# Altium schematic sheet rf_detector_adcdac.SchDoc: SPE Router
size 420 x 297 mm; Author: P. Daniel; CompanyName: WUT ISE; DrawnBy: P. Daniel; Organization: WUT ISE; Address1: WUT ISE; Address2: Nowowiejska 15/19 00-665 Warsaw; Address3: piotrmaciejdaniel@gmail.com; Revision: 1; SheetNumber: 3; SheetTotal: 6; ModifiedBy: -; CreateDate: 02-03.2023; CheckedDate: -; Title2: PoE power supply; DivGrp: WUT ISE; Designer: Piotr Daniel
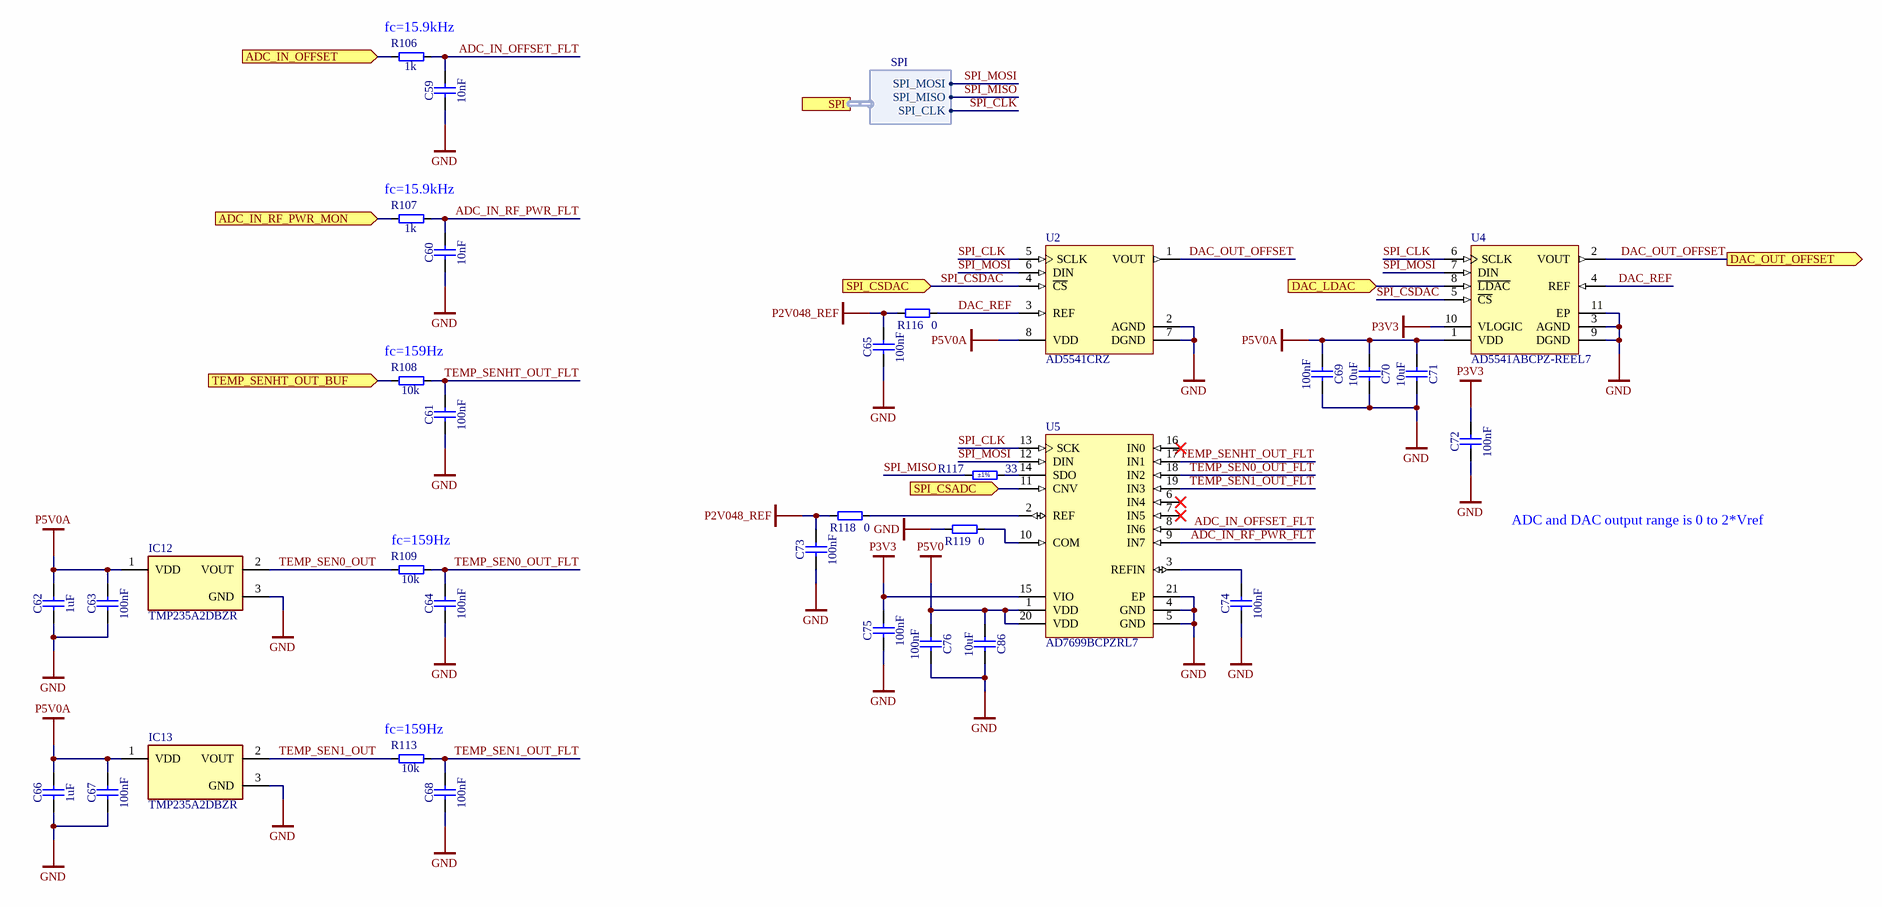
[diagram p0: rf_detector_adcdac.SchDoc]

## Parts
C59  10nF  [CAPC1005X55N]
C60  10nF  [CAPC1005X55N]
C61  100nF  [CAPC1005X55N]
C62  1uF  [CAPC1608X87N]
C63  100nF  [CAPC1005X55N]
C64  100nF  [CAPC1005X55N]
C65  100nF  [CAPC1005X55N]
C66  1uF  [CAPC1608X87N]
C67  100nF  [CAPC1005X55N]
C68  100nF  [CAPC1005X55N]
C69  100nF  [CAPC1005X55N]
C70  10uF  [CAPC2012X135N]
C71  10uF  [CAPC2012X135N]
C72  100nF  [CAPC1005X55N]
C73  100nF  [CAPC1005X55N]
C74  100nF  [CAPC1005X55N]
C75  100nF  [CAPC1005X55N]
C76  100nF  [CAPC1005X55N]
C86  10uF  [CAPC2012X135N]
IC12  TMP235A2DBZR  [FP-DBZ0003A-MFG]
IC13  TMP235A2DBZR  [FP-DBZ0003A-MFG]
R106  1k  [RESC1005X40N]
R107  1k  [RESC1005X40N]
R108  10k  [RESC1005X40N]
R109  10k  [RESC1005X40N]
R113  10k  [RESC1005X40N]
R116  0  [RESC1005X40N]
R117  33  Tolerance: ±1%  [RESC1005X40N]
R118  0  [RESC1005X40N]
R119  0  [RESC1005X40N]
U2  AD5541CRZ  [R-8_N]
U4  AD5541ABCPZ-REEL7  [CP-10-9_L]
U5  AD7699BCPZRL7  [CP-20-4_M]

## Ports
ADC_IN_OFFSET (in), ADC_IN_RF_PWR_MON (in), DAC_LDAC (in), DAC_OUT_OFFSET (out), SPI (harness SPI), SPI_CSADC (in), SPI_CSDAC (in), TEMP_SENHT_OUT_BUF (in)

## Harnesses
SPI: SPI_MOSI, SPI_MISO, SPI_CLK

## Nets
GND: C59.1 C60.1 C61.1 C62.1 C63.1 C64.1 C65.1 C66.1 C67.1 C68.1 C69.1 C70.1 C71.1 C72.1 C73.1 C74.1 C75.1 C76.1 C86.1 IC12.3(GND) IC13.3(GND) R119.2 U2.2(AGND) U2.7(DGND) U4.3(AGND) U4.9(DGND) U4.11(EP) U5.4(GND) U5.5(GND) U5.21(EP)
P2V048_REF: C65.2 C73.2 R116.2 R118.2
P3V3: C72.2 C75.2 U4.10(VLOGIC) U5.15(VIO)
P5V0: C76.2 C86.2 U5.1(VDD) U5.20(VDD)
P5V0A: C62.2 C63.2 C66.2 C67.2 C69.2 C70.2 C71.2 IC12.1(VDD) IC13.1(VDD) U2.8(VDD) U4.1(VDD)
ADC_IN_OFFSET: R106.1 ; port ADC_IN_OFFSET
ADC_IN_OFFSET_FLT: C59.2 R106.2 U5.8(IN6)
ADC_IN_RF_PWR_FLT: C60.2 R107.2 U5.9(IN7)
ADC_IN_RF_PWR_MON: R107.1 ; port ADC_IN_RF_PWR_MON
DAC_LDAC: U4.8(~{LDAC}) ; port DAC_LDAC
DAC_OUT_OFFSET: U2.1(VOUT) U4.2(VOUT) ; port DAC_OUT_OFFSET
DAC_REF: R116.1 U2.3(REF) U4.4(REF)
SPI_CLK: U2.5(SCLK) U4.6(SCLK) U5.13(SCK) ; port SPI.SPI_CLK
SPI_CSADC: U5.11(CNV) ; port SPI_CSADC
SPI_CSDAC: U2.4(~{CS}) U4.5(~{CS}) ; port SPI_CSDAC
SPI_MISO: R117.1 ; port SPI.SPI_MISO
SPI_MOSI: U2.6(DIN) U4.7(DIN) U5.12(DIN) ; port SPI.SPI_MOSI
TEMP_SEN0_OUT: IC12.2(VOUT) R109.1
TEMP_SEN0_OUT_FLT: C64.2 R109.2 U5.18(IN2)
TEMP_SEN1_OUT: IC13.2(VOUT) R113.1
TEMP_SEN1_OUT_FLT: C68.2 R113.2 U5.19(IN3)
TEMP_SENHT_OUT_BUF: R108.1 ; port TEMP_SENHT_OUT_BUF
TEMP_SENHT_OUT_FLT: C61.2 R108.2 U5.17(IN1)
NetC74_2: C74.2 U5.3(REFIN)
NetR117_2: R117.2 U5.14(SDO)
NetR118_1: R118.1 U5.2(REF)
NetR119_1: R119.1 U5.10(COM)

Not connected (* = marked no-connect by the designer): U5 6(IN4)* 7(IN5)* 16(IN0)*

## Notes on the sheet
- (near R106) fc=15.9kHz
- (near R107) fc=15.9kHz
- (near R108) fc=159Hz
- (near R109) fc=159Hz
- ADC and DAC output range is 0 to 2*Vref
- (near R113) fc=159Hz
- Project/Equipment
- Document
- Designer
- Drawn by
- Check.by
- Copyright WUT ISE 2021.
  This documentation describes Open Hardware and is licensed under the CERN OHL v.1.1. You may redistribute and modify this documentation under the terms of the CERN OHL v.1.1. (http://ohwr.org/CERNOHL). This documentation is distributed WITHOUT ANY EXPRESS OR IMPLIED WARRANTY, INCLUDING OF MERCHANTABILITY, SATISFACTORY QUALITY AND FITNESS FOR A PARTICULAR PURPOSE. Please see the CERN OHL v.1.1 for applicable conditions.
- Contact
- File
- Last Mod.
- Print Date
- Sheet
- Size
- A3
- of
- Rev

## Library data of the parts
C59 C60 = CC0402_10NF_25V_10%_X7R: Non-polarised capacitor; Part Description: SMD Multilayer Chip Ceramic Capacitor; Manufacturer: GENERIC; Manufacturer1 Part Number: C1005X7R1E103K050; Voltage: 25V; TC: X7R; Tolerance: ±10%; Part Number: CC0402_10NF_25V_10%_X7R; Component Kind: Standard; Component Type: Standard; Pin Count: 2; Value: 10nF; Status: Preferred; Manufacturer Part Number: CC0402_10NF_25V_10%_X7R; Case: 0402; Mounted: Yes; Socket: No; SMD: Yes; Sense: No; Manufacturer1 Example: TDK; Manufacturer1 ComponentHeight: 0.55mm; HelpURL: \\cern.ch\dfs\Applications\Altium\Datasheets\CC0402_X7R_TDK_C.pdf; Author: CERN DEM JLC; CreateDate: 25.10.2012; LatestRevisionDate: 25.10.2012
C61 C63-C65 C67-C69 C72-C76 = CC0402_100NF_16V_10%_X7R: Non-polarised capacitor; Part Description: SMD Multilayer Chip Ceramic Capacitor; Manufacturer: GENERIC; Manufacturer1 Part Number: GRM155R71C104KA88D; Voltage: 16V; TC: X7R; Tolerance: ±10%; Part Number: CC0402_100NF_16V_10%_X7R; Component Kind: Standard; Component Type: Standard; Pin Count: 2; Value: 100nF; Status: Not Recommended; Manufacturer Part Number: CC0402_100NF_16V_10%_X7R; Case: 0402; Mounted: Yes; Socket: No; SMD: Yes; Sense: No; Manufacturer1 Example: MURATA; Manufacturer1 ComponentHeight: 0.55mm; HelpURL: \\cern.ch\dfs\Applications\Altium\Datasheets\CC0402_X7R_MURATA_GRM.pdf; Author: CERN DEM JLC; CreateDate: 05.12.2013; LatestRevisionDate: 03.12.2007
C62 C66 = CC0603_1UF_25V_10%_X7R: Non-polarised capacitor; Part Description: SMD Multilayer Chip Ceramic Capacitor; Manufacturer: GENERIC; Manufacturer1 Part Number: GRM188R71E105KA12D; Voltage: 25V; TC: X7R; Tolerance: ±10%; Part Number: CC0603_1UF_25V_10%_X7R; Component Kind: Standard; Component Type: Standard; Pin Count: 2; Value: 1uF; Status: None; Manufacturer Part Number: CC0603_1UF_25V_10%_X7R; Case: 0603; Mounted: Yes; Socket: No; SMD: Yes; Sense: No; Manufacturer1 Example: MURATA; Manufacturer1 ComponentHeight: 0.9mm; HelpURL: \\cern.ch\dfs\Applications\Altium\Datasheets\CC0603_X7R_MURATA.pdf; Author: CERN DEM JLC; CreateDate: 18.01.2011; LatestRevisionDate: 18.01.2011
C70 C71 C86 = CC0805_10UF_10V_10%_X7R: Non-polarised capacitor; Part Description: SMD Multilayer Chip Ceramic Capacitor; Manufacturer: GENERIC; Manufacturer1 Part Number: GRM21BR71A106KE51L; Voltage: 10V; TC: X7R; Tolerance: ±10%; Part Number: CC0805_10UF_10V_10%_X7R; Component Kind: Standard; Component Type: Standard; Pin Count: 2; Value: 10uF; Status: Preferred; Manufacturer Part Number: CC0805_10UF_10V_10%_X7R; Case: 0805; Mounted: Yes; Socket: No; SMD: Yes; Sense: No; Manufacturer1 Example: MURATA; Manufacturer1 ComponentHeight: 1.35mm; HelpURL: \\cern.ch\dfs\Applications\Altium\Datasheets\CC0805_X7R_MURATA.pdf; Author: CERN DEM JLC; CreateDate: 30.04.2012; LatestRevisionDate: 30.04.2012
IC12 IC13 = CMP-04948-000003-1: LOW-POWER HIGH-ACCURACY ANALOG O; Manufacturer: Texas Instruments; Output Current: 500uA; Operating Supply Current: 9uA; Max Supply Voltage: 5.5V; Max Junction Temp: +150°C; Accuracy: 0.5%; Min Supply Voltage: 2.3V; Standoff Height: 0.01mm; Sensor Output: Analog Voltage; Ambient Temperature Range Low: -40°C; Device Class L2: Temperature and Humidity Sensors; Digikey Description: LOW-POWER HIGH-ACCURACY ANALOG O; Lead Free: Yes; Category: IC; Device Class L3: unset; Temperature Range Low: -40°C; Manufacturer Part Number: TMP235A2DBZR; ComponentLink2Description: Datasheet; Package: DBZ0003A; Octopart: https://octopart.com/tmp235a2dbzr-texas+instruments-94966376; Device Class L1: Sensors; Temperature Range High: +150°C; Height: 1.12mm; Temperature: -40°C to +150°C; RoHS: TRUE; Ambient Temperature Range High: +150°C; Automotive: No; ComponentLink2URL: http://www.ti.com/lit/ds/symlink/tmp235.pdf; Mouser Description: ±2°C Analog output temperature sensor, with 10mV /°C gain 3-SOT-23 -40 to 150; Part Number: TMP235A2DBZR
R106 R107 = R0402_1K_1%_0.0625W_100PPM: Resistor - 1%; Part Description: General Purpose Thick Film Chip Resistor; Manufacturer: GENERIC; Manufacturer1 Part Number: 232270671002L; TC: ±100ppm/°C; PressFit: No; Part Number: R0402_1K_1%_0.0625W_100PPM; Component Kind: Standard; Component Type: Standard; Pin Count: 2; Value: 1k; Status: Not Recommended; Power: 0.0625W; Tolerance: ±1%; Manufacturer Part Number: R0402_1K_1%_0.0625W_100PPM; Case: 0402; Mounted: Yes; Sense: No; Socket: No; SMD: Yes; Manufacturer1 Example: YAGEO PHYCOMP; Manufacturer1 ComponentHeight: 0.4mm; HelpURL: \\cern.ch\dfs\Applications\Altium\Datasheets\R0402_Phycomp_RC0402.pdf; Author: CERN DEM JLC; CreateDate: 03.12.2007; LatestRevisionDate: 17.10.2012
R108 R109 R113 = R0402_10K_1%_0.0625W_100PPM: Resistor - 1%; Part Description: General Purpose Thick Film Chip Resistor; Manufacturer: GENERIC; Manufacturer1 Part Number: 232270671003L; TC: ±100ppm/°C; PressFit: No; Part Number: R0402_10K_1%_0.0625W_100PPM; Component Kind: Standard; Component Type: Standard; Pin Count: 2; Value: 10k; Status: Not Recommended; Power: 0.0625W; Tolerance: ±1%; Manufacturer Part Number: R0402_10K_1%_0.0625W_100PPM; Case: 0402; Mounted: Yes; Sense: No; Socket: No; SMD: Yes; Manufacturer1 Example: YAGEO PHYCOMP; Manufacturer1 ComponentHeight: 0.4mm; HelpURL: \\cern.ch\dfs\Applications\Altium\Datasheets\R0402_Phycomp_RC0402.pdf; Author: CERN DEM JLC; CreateDate: 03.12.2007; LatestRevisionDate: 17.10.2012
R116 R118 R119 = R0402_0R_JUMPER: Resistor; Part Description: 1A (0.05R Max DC Resistance) Zero Ohm Jumper; Manufacturer: GENERIC; Manufacturer1 Part Number: 232270591001L; Part Number: R0402_0R_JUMPER; Component Kind: Standard; Component Type: Standard; Pin Count: 2; Value: 0; Status: Not recommended; Manufacturer Part Number: R0402_0R_JUMPER; Case: 0402; Mounted: Yes; Sense: No; Socket: No; SMD: Yes; Manufacturer1 Example: YAGEO PHYCOMP; Manufacturer1 ComponentHeight: 0.4mm; HelpURL: \\cern.ch\dfs\Applications\Altium\Datasheets\R0402_Phycomp_RC0402.pdf; Author: CERN DEM JLC; CreateDate: 03.12.2007; LatestRevisionDate: 17.10.2012
R117 = R0402_33R_1%_0.0625W_100PPM: Resistor - 1%; Part Description: General Purpose Thick Film Chip Resistor; Manufacturer: GENERIC; Manufacturer1 Part Number: 232270673309L; TC: ±100ppm/°C; PressFit: No; Part Number: R0402_33R_1%_0.0625W_100PPM; Component Kind: Standard; Component Type: Standard; Pin Count: 2; Value: 33; Status: Not Recommended; Power: 0.0625W; Manufacturer Part Number: R0402_33R_1%_0.0625W_100PPM; Case: 0402; Mounted: Yes; Sense: No; Socket: No; SMD: Yes; Manufacturer1 Example: YAGEO PHYCOMP; Manufacturer1 ComponentHeight: 0.4mm; HelpURL: \\cern.ch\dfs\Applications\Altium\Datasheets\R0402_Phycomp_RC0402.pdf; Author: CERN DEM JLC; CreateDate: 03.12.2007; LatestRevisionDate: 17.10.2012
U2 = CMP-0318-00925-2: Single 16-Bit Digital-to-Analog Converter with Serial Interface, 2.7 to 5.5 V, -40 to +85 degC, R-8, Pb-Free, Tube; Manufacturer: Analog Devices; Generic Part Number: AD5541; Max V+: 5.5V; Op Pwr Diss: 6.05mW; Settling Time: 1Âµs; # DAC Outputs: 1; Resolution (Bits): 16; Single Supply: Yes; ComponentLink3Description: Package Specification; Packing: Tube; Code_IPC: SOIC127P600-8; ComponentLink2Description: Datasheet; RoHS: Y; ComponentLink3URL: http://www.analog.com/static/imported-files/packages/PKG_PDF/SOIC_Narrow%20(R)/R_8.pdf; PackageVersion: 060506-A; Code_JEDEC: MS-012-AA; ComponentLink5Description: Reference Design URL; PackageReference: R-8; ComponentLink5URL: http://www.analog.com/en/digital-to-analog-converters/da-converters/ad5541/products/product.html#prod_cross_sell; ComponentLink4URL: http://www.analog.com/en/digital-to-analog-converters/da-converters/ad5541/products/product.html; ComponentLink1URL: http://www.analog.com/en/index.html; Mounting Technology: Surface Mount; PackageDescription: 8-Lead Standard Small Outline Package [SOIC_N] Narrow Body; ComponentLink2URL: http://www.analog.com/static/imported-files/data_sheets/AD5541_5542.pdf; PartNumber: AD5541CRZ; ComponentLink4Description: Product URL; DatasheetVersion: Rev.F; ComponentLink1Description: Manufacturer URL; RevisionNote: Component URL fixed
U4 = CMP-0318-01240-2: Single 16-Bit Voltage Output Digital-to-Analog Converter with Serial Interface, 2.7 to 5.5 V, -40 to +125 degC, CP-10-9, Pb-Free, Reel; Manufacturer: Analog Devices; Settling Time: 1Âµs; Single Supply: Yes; Max V+: 5.5V; Op Pwr Diss: 600ÂµW; Resolution (Bits): 16; # DAC Outputs: 1; ComponentLink2Description: Datasheet; ComponentLink1Description: Manufacturer URL; DatasheetVersion: Rev.A; ComponentLink3Description: Package Specification; Generic Part Number: AD5541A; ComponentLink4Description: Product URL; Mounting Technology: Surface Mount; ComponentLink3URL: http://www.analog.com/static/imported-files/packages/CP_10_9.pdf; RoHS: Y; PackageVersion: 02-27-2012-B; Packing: Reel; PackageDescription: 10-Lead Lead Frame Chip Scale Package [LFCSP_WD] 3 x 3 mm Body, Very Very Thin, Dual Lead; ComponentLink1URL: http://www.analog.com/en/index.html; RevisionNote: Component URL fixed; ComponentLink4URL: http://www.analog.com/en/digital-to-analog-converters/da-converters/ad5541a/products/product.html; ComponentLink2URL: http://www.analog.com/static/imported-files/data_sheets/AD5541A.pdf; PackageReference: CP-10-9; PartNumber: AD5541ABCPZ-REEL7
U5 = CMP-0313-00572-2: Octal 16-Bit PulSAR Analog-to-Digital Converter with Serial, SPI Interface, 500KSPS, -40 to +85 degC, CP-20-4, Pb-Free, Reel; Generic Part Number: AD7699; Manufacturer: Analog Devices; Resolution (Bits): 16; Interface: Ser, SPI; Throughput Rate (SPS): 500K; Channels: 8; ComponentLink2Description: Datasheet; ComponentLink1URL: http://www.analog.com/en/index.html; Packing: Reel; ComponentLink1Description: Manufacturer URL; ComponentLink4URL: http://www.analog.com/en/analog-to-digital-converters/ad-converters/ad7699/products/product.html; ComponentLink4Description: Product URL; PackageReference: CP-20-4; PartNumber: AD7699BCPZRL7; PackageVersion: 012508-B; ComponentLink3Description: Package Specification; PackageDescription: 20-Lead Lead Frame Chip Scale Package [LFCSP_VQ] 4 x 4 mm Body, Very Thin Quad; DatasheetVersion: Rev.B; Code_JEDEC: MO-220-VGGD-1; Mounting Technology: Surface Mount; RoHS: Y; ComponentLink3URL: http://www.analog.com/static/imported-files/packages/PKG_PDF/LFCSP(CP)/CP_20_4.pdf; ComponentLink2URL: http://www.analog.com/static/imported-files/data_sheets/AD7699.pdf